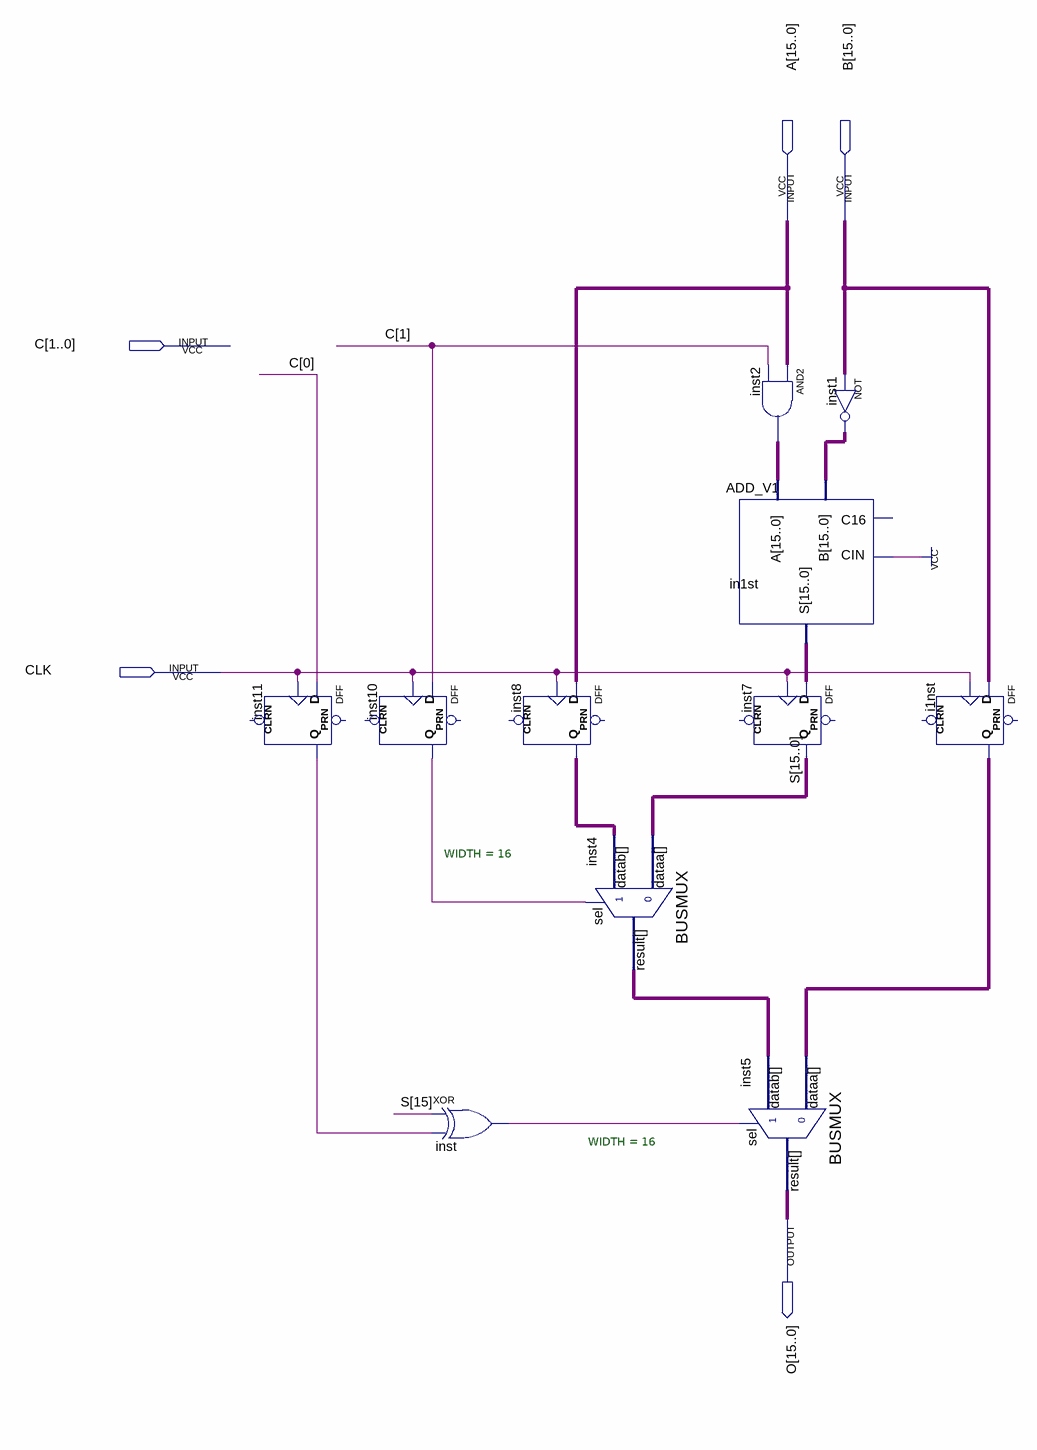
[diagram p0: schematic sheet]
// Quartus schematic ABSMINMAX_PL.bdf as structural Verilog: 11 symbols, 5 pins
module ABSMINMAX_PL (
  input  [15:0] A,
  input  [15:0] B,
  input  [1:0] C,
  input  CLK,
  output [15:0] O
);

  wire inst10_q, inst11_q, inst_out;
  wire [15:0] i1nst_q, in1st_s, inst1_out, inst2_out, inst4_result, inst8_q, S;

  DFF inst11 (.CLK(CLK), .D(C[0]), .Q(inst11_q));  // open: CLRN, PRN
  DFF inst10 (.CLK(CLK), .D(C[1]), .Q(inst10_q));  // open: CLRN, PRN
  xor inst (inst_out, S[15], inst11_q);
  DFF inst8[15:0] (.CLK(CLK), .D(A), .Q(inst8_q));  // open: CLRN, PRN
  BUSMUX #(.WIDTH(16)) inst4 (.datab(inst8_q), .sel(inst10_q), .dataa(S), .result(inst4_result));
  assign inst2_out = A & {16{C[1]}};  // AND2 inst2, 16 bits wide
  ADD_V1 in1st (.A(inst2_out), .B(inst1_out), .CIN(1'b1), .S(in1st_s));  // open: C16
  DFF inst7[15:0] (.CLK(CLK), .D(in1st_s), .Q(S));  // open: CLRN, PRN
  BUSMUX #(.WIDTH(16)) inst5 (.datab(inst4_result), .sel(inst_out), .dataa(i1nst_q), .result(O));
  assign inst1_out = ~B;  // NOT inst1, 16 bits wide
  DFF i1nst[15:0] (.CLK(CLK), .D(B), .Q(i1nst_q));  // open: CLRN, PRN
endmodule
